# EAGLE design ESP12-breakout-smt-rev1 (EAGLE 7.5.0)
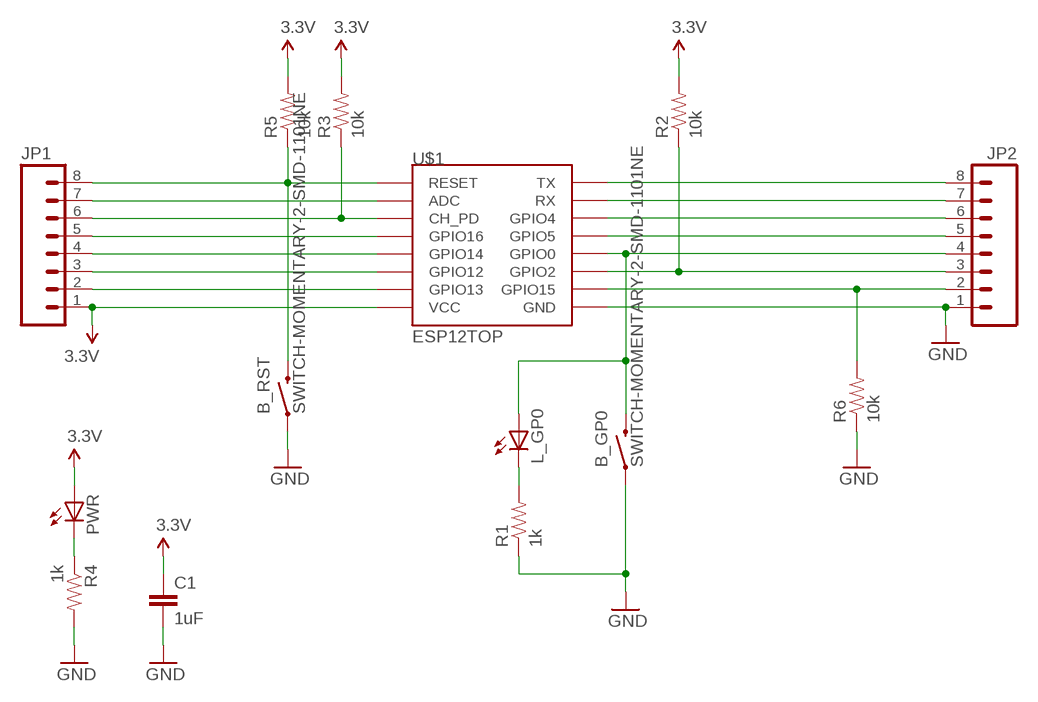
[diagram p0: schematic, sheet 1]

## Parts
B_GP0  SWITCH-MOMENTARY-2-SMD-1101NE  [TACTILE-SWITCH-1101NE]
B_RST  SWITCH-MOMENTARY-2-SMD-1101NE  [TACTILE-SWITCH-1101NE]
C1  1uF  CAP0805  [0805]
JP1  M08  [1X08_PIN1_NO_SILK]
JP2  M08  [1X08_PIN1_NO_SILK]
L_GP0  LEDCHIPLED_0805  [CHIPLED_0805]
PWR  LEDCHIPLED_0805  [CHIPLED_0805]
R1  1k  RESISTOR0603  [0603-RES]
R2  10k  RESISTOR0603  [0603-RES]
R3  10k  RESISTOR0603  [0603-RES]
R4  1k  RESISTOR0603  [0603-RES]
R5  10k  RESISTOR0603  [0603-RES]
R6  10k  RESISTOR0603  [0603-RES]
U$1  ESP12TOP  [ESP12TOP]

## Nets
3.3V: C1.1 JP1.1 PWR.A R2.2 R3.2 R5.2 U$1.VCC
GND: B_GP0.1 B_RST.1 C1.2 JP2.1 R1.1 R4.2 R6.1 U$1.GND
N$1: L_GP0.C R1.2
N$2: JP1.2 U$1.GPIO13
N$3: JP1.3 U$1.GPIO12
N$4: JP1.4 U$1.GPIO14
N$5: JP1.5 U$1.GPIO16
N$6: JP1.6 R3.1 U$1.CH_PD
N$7: JP1.7 U$1.ADC
N$8: B_RST.2 JP1.8 R5.1 U$1.RESET
N$9: PWR.C R4.1
N$10: JP2.2 R6.2 U$1.GPIO15
N$11: JP2.3 R2.1 U$1.GPIO2
N$12: B_GP0.2 JP2.4 L_GP0.A U$1.GPIO0
N$13: JP2.5 U$1.GPIO5
N$14: JP2.6 U$1.GPIO4
N$15: JP2.7 U$1.RXD(RX)
N$16: JP2.8 U$1.TXD(TX)

## Library data of the parts
B_GP0 B_RST = SparkFun-Electromechanical:SWITCH-MOMENTARY-2: Various NO switches- pushbuttons, reed, etc
C1 = SparkFun-Capacitors:CAP: Capacitor Standard 0603 ceramic capacitor, and 0.1" leaded capacitor.
JP1 JP2 = SparkFun-Connectors:M08: Header 8 Standard 8-pin 0.1" header. Use with straight break away headers (SKU : PRT-00116), right angle break away headers (PRT-00553), swiss pins (PRT-00743), machine pins (PRT-00117), and female headers (PRT-00115).
L_GP0 PWR = adafruit:LED: LED OSRAM: - CHIPLED LG R971, LG N971, LY N971, LG Q971, LY Q971, LO R971, LY R971 LH N974, LH R974 LS Q976, LO Q976, LY Q976 LO Q996 - Hyper CHIPLED LW Q18S LB Q993, LB Q99A, LB R99A - SideLED LS A670, LO A670, LY A670, LG A670, LP A670 LB A673, LV A673, LT A673, LW A673 LH A674 LY A675 LS A676, LA A676, LO A676, LY A676, LW A676 LS A679, LY A679, LG A679 - Hyper Micro SIDELED® LS Y876, LA Y876, LO Y876, LY Y876 LT Y87S - SmartLED LW L88C, LW L88S LB L89C, LB L89S, LG L890 LS L89K, LO L89K, LY L89K LS L896, LA L896, LO L896, LY L896 - TOPLED LS T670, LO T670, LY T670, LG T670, LP T670 LSG T670, LSP T670, LSY T670, LOP T670, LYG T670 LG T671, LOG T671, LSG T671 LB T673, LV T673, LT T673, LW T673 LH T674 LS T676, LA T676, LO T676, LY T676, LB T676, LH T676, LSB T676, LW T676 LB T67C, LV T67C, LT T67C, LS T67K, LO T67K, LY T67K, LW E67C LS E67B, LA E67B, LO E67B, LY E67B, LB E67C, LV E67C, LT E67C LW T67C LS T679, LY T679, LG T679 LS T770, LO T770, LY T770, LG T770, LP T770 LB T773, LV T773, LT T773, LW T773 LH T774 LS E675, LA E675, LY E675, LS T675 LS T776, LA T776, LO T776, LY T776, LB T776 LHGB T686 LT T68C, LB T68C - Hyper Mini TOPLED® LB M676 - Mini TOPLED Santana® LG M470 LS M47K, LO M47K, LY M47K Source: http://www.osram.convergy.de/
R1-R6 = SparkFun-Resistors:RESISTOR: Resistor Basic schematic elements and footprints for 0603, 1206, and PTH resistors.
U$1 = esp8266modules:ESP12: ESP8266 Wifi module 12

## Board
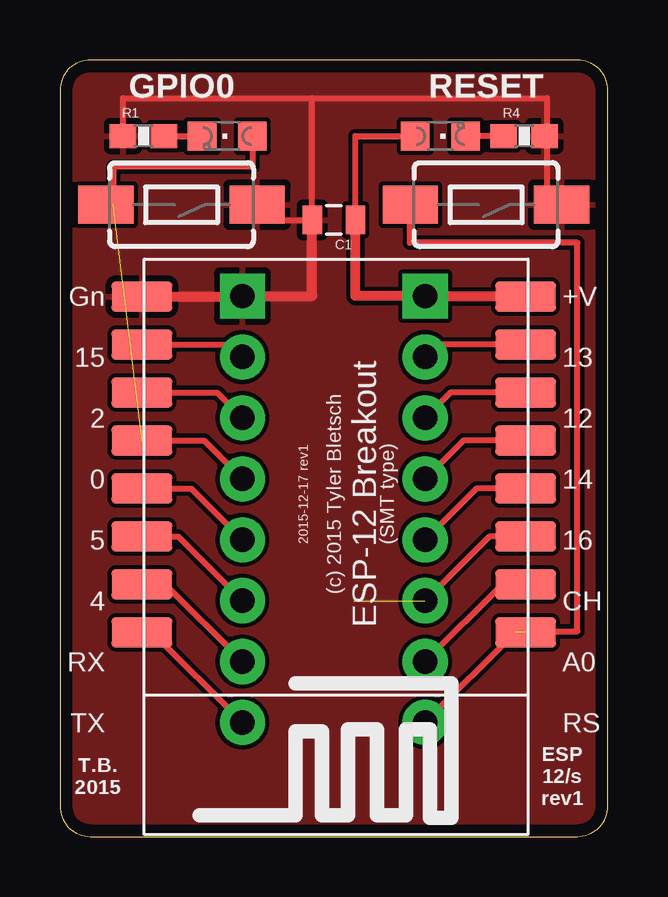
[diagram p1: board, top side]
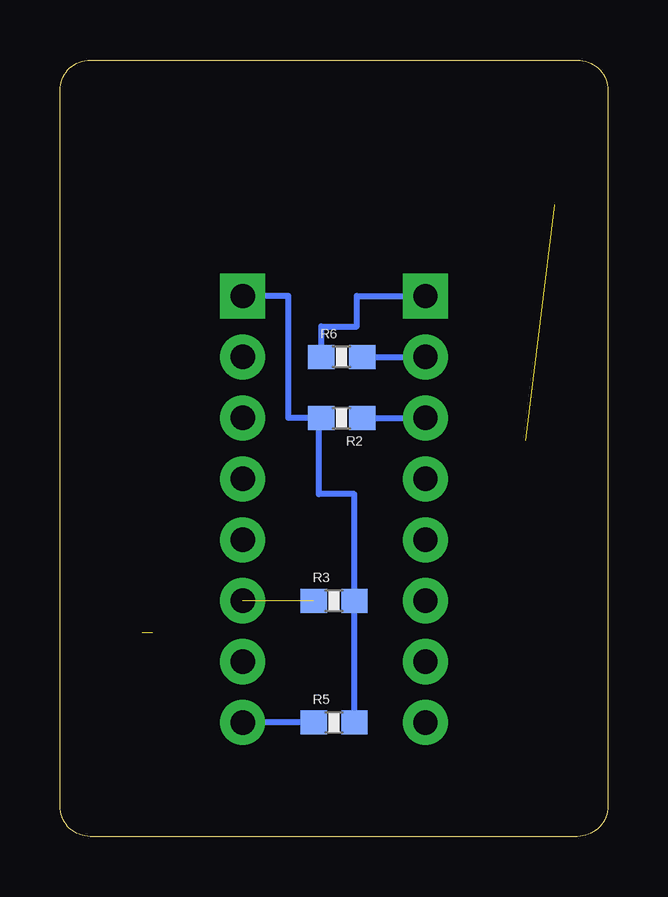
[diagram p2: board, bottom side, seen from below]

Size 22.85 x 32.38 mm. Coordinates in mm from the lower left corner, seen from the top.
Outline: 22.85,1.27 22.85,31.11 arc90 21.58,32.37 1.27,32.37 arc90 0,31.11 0,1.27 arc90 1.27,0 21.58,0 arc90 22.85,1.27
Copper layers (1*16): Top 0.035mm / dielectric 1.5mm / Bottom 0.035mm
Design rules "smart-prototyping": minimum track width 7mil, minimum drill 12mil, track to track 7mil, track to pad 7mil, pad to pad 7mil, via to via 7mil, smd to smd 0mil, copper to edge 20mil, drill to drill 10mil, minimum pad ring 10mil, minimum via ring 6mil, stop-mask expansion 2mil, vias tented up to drill 25mil, thermal gap 10mil

### Footprints (pad centres in the part's own frame; a part is rotated, then mirrored left to right if it is on the bottom)
TACTILE-SWITCH-1101NE = smd 2.3 x 1.6: 1 -3.15,0; 2 3.15,0
0805 = smd 0.8 x 1.2: 1 -0.9,0; 2 0.9,0
1X08_PIN1_NO_SILK = drill 1.016 pad 1.88 square: 1 0,0 | drill 1.016 pad 1.88: 2 2.54,0; 3 5.08,0; 4 7.62,0; 5 10.16,0; 6 12.7,0; 7 15.24,0; 8 17.78,0
CHIPLED_0805 = smd 1.2 x 1.2: A 0,-1.05; C 0,1.05
0603-RES = smd 1.1 x 1: 1 -0.85,0; 2 0.85,0
ESP12TOP = smd 2.54 x 1.27: ADC -8,3.77; CH_PD -8,1.77; GND 8,-8.23; GPIO0 8,-2.23; GPIO2 8,-4.23; GPIO4 8,1.77; GPIO5 8,-0.23; GPIO12 -8,-4.23; GPIO13 -8,-6.23; GPIO14 -8,-2.23; GPIO15 8,-6.23; GPIO16 -8,-0.23; RESET -8,5.77; RXD 8,3.77; TXD 8,5.77; VCC -8,-8.23

### Placement (x,y rotation side)
B_GP0  5.07,26.34 180 top
B_RST  17.77,26.34 180 top
C1  11.42,25.71 180 top
JP1  15.23,22.53 270 top
JP2  7.61,22.53 270 top
L_GP0  6.97,29.2 90 top
PWR  15.86,29.2 270 top
R1  3.48,29.2 0 top
R2  11.1,17.45 180 bottom
R3  11.42,9.83 0 bottom
R4  19.36,29.2 0 top
R5  11.42,4.75 0 bottom
R6  11.1,19.99 0 bottom
U$1  11.42,14.28 180 top

### Tracks (layer width: path | path; a pad name or v marks a point on that pad's centre or on a via)
3.3V
  Top 0.254: C1.1 12.32,29.2 PWR.A
  Top 0.406: U$1.VCC 15.25,22.51 JP1.1 12.32,22.53 C1.1
  Bottom 0.254: R5.2 R3.2 10.57,14.28 12.05,14.28 12.05,17.45 R2.2 13.32,17.45 13.32,22.53 JP1.1
GND
  Top 0.254: 10.52,30.79 C1.2 8.22,25.71 B_GP0.1 | 10.52,30.79 20.31,30.79 20.31,29.2 | 20.31,29.2 R4.2 | 20.31,29.2 20.31,26.34 B_RST.1 | R1.1 2.63,30.79 10.52,30.79
  Top 0.406: U$1.GND 7.58,22.51 JP2.1 10.52,22.53 C1.2
  Bottom 0.254: R6.1 11.95,21.26 10.47,21.26 10.47,22.53 JP2.1
  pour Top: -5.09,43.49 31.74,43.49 31.74,37.14 34.28,37.14 34.28,-2.23 -5.09,-2.23
N$1
  Top 0.254: R1.2 L_GP0.C
N$2
  Top 0.254: U$1.GPIO13 15.74,20.51 JP1.2
N$3
  Top 0.254: U$1.GPIO12 16.28,18.51 JP1.3
N$4
  Top 0.254: U$1.GPIO14 16.82,16.51 JP1.4
N$5
  Top 0.254: U$1.GPIO16 17.36,14.51 JP1.5
N$6  (1 unrouted)
  Top 0.254: U$1.CH_PD 17.9,12.51 JP1.6
N$7
  Top 0.254: U$1.ADC 18.44,10.51 JP1.7
N$8  (1 unrouted)
  Top 0.254: JP1.8 18.98,8.51 18.98,8.56 21.58,8.56 21.58,24.76 14.59,24.76 14.59,26.34 B_RST.2
  Bottom 0.254: R5.1 JP1.8
N$9
  Top 0.254: R4.1 PWR.C
N$10
  Top 0.254: U$1.GPIO15 7.09,20.51 JP2.2
  Bottom 0.254: R6.2 JP2.2
N$11
  Top 0.254: U$1.GPIO2 6.55,18.51 JP2.3
  Bottom 0.254: R2.1 JP2.3
N$12  (1 unrouted)
  Top 0.254: U$1.GPIO0 6.01,16.51 JP2.4 | L_GP0.A 8.02,27.93 2.21,27.93 2.21,26.34 B_GP0.2
N$13
  Top 0.254: U$1.GPIO5 5.47,14.51 JP2.5
N$14
  Top 0.254: U$1.GPIO4 4.93,12.51 JP2.6
N$15
  Top 0.254: U$1.RXD 4.39,10.51 JP2.7
N$16
  Top 0.254: U$1.TXD 3.85,8.51 JP2.8

### Text on the board
tPlace: GPIO0 | RESET | Gn | +V | 15 | 13 | 2 | 12 | 0 | 14 | 2015-12-17 rev1 | (c) 2015 Tyler Bletsch | ESP-12 Breakout | 5 | 16 | 4 | CH | RX | A0 | TX | RS | T.B. / 2015 | ESP / 12/s / rev1
tNames: (SMT type)